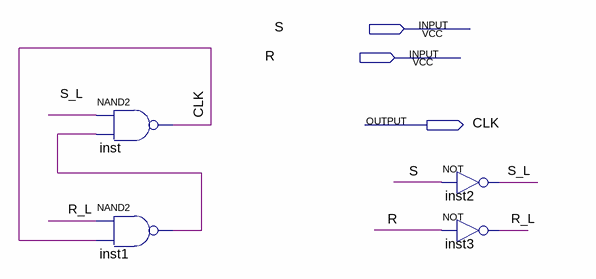
[diagram p0: schematic sheet]
// Quartus schematic hw7latch.bdf as structural Verilog: 4 symbols, 3 pins
module hw7latch (
  input  S,
  input  R,
  output CLK
);

  wire inst1_out, R_L, S_L;

  nand inst (CLK, S_L, inst1_out);
  nand inst1 (inst1_out, R_L, CLK);
  not inst2 (S_L, S);
  not inst3 (R_L, R);
endmodule
